# Altium schematic sheet 3.3V_Regulator.SchDoc
size A; SheetNumber: 1; SheetTotal: 7
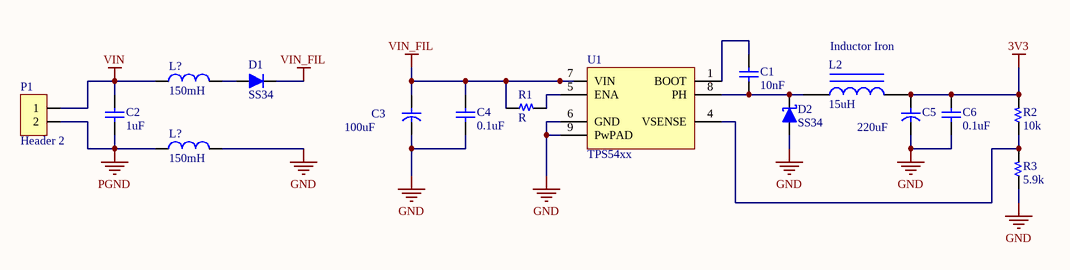
[diagram p0: 3.3V_Regulator.SchDoc]

## Parts
(Parts that share a designator on the sheet are numbered #1, #2 ... from top to bottom, then left to right.)
C1  10nF  [C 0805]
C2  1uF  [C 0805]
C3  100uF  [C SMD TAN 1206 (A)]
C4  0.1uF  [C 0805]
C5  220uF  [C SMD TAN 1206 (A)]
C6  0.1uF  [C 0805]
D1  SS34  [DO-35 (SOD27 )]
D2  SS34  [DO-41]
L2  Inductor Iron  value 15uH  [Inductor SMD 0805 (2012)]
L?#1  150mH  [L/0.4]
L?#2  150mH  [L/0.4]
P1  Header 2  [HDR/Header/2]
R1  R  [R 0805]
R2  10k  [R 0805]
R3  5.9k  [R 0805]
U1  TPS54xx  [SOIC-8 EP]

## Nets
3V3: C5.1 C6.1 L2.2 R2.2
GND: C3.2 C4.2 C5.2 C6.2 D2.1(A) L?#2.2 R3.1 U1.6(GND) U1.9(PwPAD)
PGND: C2.1 L?#2.1 P1.2
VIN: C2.2 L?#1.1 P1.1
VIN_FIL: C3.1 C4.1 D1.2(K) R1.1 U1.7(VIN)
NetC1_1: C1.1 U1.1(BOOT)
NetC1_2: C1.2 D2.2(K) L2.1 U1.8(PH)
NetD1_1: D1.1(A) L?#1.2
NetR1_2: R1.2 U1.5(ENA)
NetR2_1: R2.1 R3.2 U1.4(VSENSE)

## Library data of the parts
C1 C2 C4 C6 = Capacitor NP: Capacitor non-pol
C3 C5 = Capacitor: Capacitor pol
D1 = Diode: Default Diode
D2 = Diode Schottky: Schottky Diode
L2 = Inductor Iron: Magnetic-Core Inductor; Published: 24-Mar-1999; LatestRevisionDate: 17-Jul-2002; LatestRevisionNote: Re-released for DXP Platform.; PackageReference: AXIAL-0.9; Publisher: Altium Limited; PackageDescription: Axial Device, Thru-Hole; 2 Leads; 0.9 in Pin Spacing
L?#1 L?#2 = L1: Inductor; Value: 150 mH
P1 = Header 2: Header, 2-Pin
R1-R3 = Resistor
U1 = TPS54xx: 3/5A, Wide input range, Step-down SWIFT DC-DC Converter